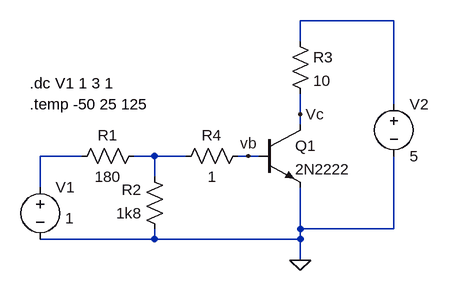
[diagram p0: schematic NPN_switch_dcSweep.asc]
NPN_switch_dcSweep.asc, the LTspice schematic file:
Version 4
SHEET 1 880 680
WIRE 544 -64 400 -64
WIRE 400 -32 400 -64
WIRE 544 64 544 -64
WIRE 400 80 400 48
WIRE 400 96 400 80
WIRE 64 144 0 144
WIRE 176 144 144 144
WIRE 224 144 176 144
WIRE 320 144 304 144
WIRE 336 144 320 144
WIRE 176 176 176 144
WIRE 0 192 0 144
WIRE 400 256 400 192
WIRE 544 256 544 144
WIRE 544 256 400 256
WIRE 176 272 176 256
WIRE 176 272 0 272
WIRE 400 272 400 256
WIRE 400 272 176 272
WIRE 400 304 400 272
FLAG 400 304 0
FLAG 400 80 Vc
FLAG 320 144 vb
SYMBOL res 160 128 R90
WINDOW 0 0 56 VBottom 2
WINDOW 3 32 56 VTop 2
SYMATTR InstName R1
SYMATTR Value 180
SYMBOL res 192 272 R180
WINDOW 0 36 76 Left 2
WINDOW 3 36 40 Left 2
SYMATTR InstName R2
SYMATTR Value 1k8
SYMBOL npn 336 96 R0
SYMATTR InstName Q1
SYMATTR Value 2N2222
SYMBOL res 384 -48 R0
SYMATTR InstName R3
SYMATTR Value 10
SYMBOL voltage 0 176 R0
WINDOW 3 38 64 Left 2
WINDOW 123 0 0 Left 0
WINDOW 39 0 0 Left 0
SYMATTR InstName V1
SYMATTR Value 1
SYMBOL voltage 544 48 R0
WINDOW 123 0 0 Left 0
WINDOW 39 0 0 Left 0
SYMATTR InstName V2
SYMATTR Value 5
SYMBOL res 320 128 R90
WINDOW 0 0 56 VBottom 2
WINDOW 3 32 56 VTop 2
SYMATTR InstName R4
SYMATTR Value 1
TEXT -16 32 Left 2 !.dc V1 1 3 1
TEXT -16 64 Left 2 !.temp -50 25 125

The netlist it stands for:
* NPN_switch_dcSweep.asc
R1 N003 N002 180
R2 0 N003 1k8
Q1 Vc vb 0 0 2N2222
R3 N001 Vc 10
V1 N002 0 1
V2 N001 0 5
R4 vb N003 1
.model NPN NPN
.model PNP PNP
.lib standard.bjt
.dc V1 1 3 1
.temp -50 25 125
.backanno
.end

* Results of the author's LTspice run, read from the files saved beside the schematic
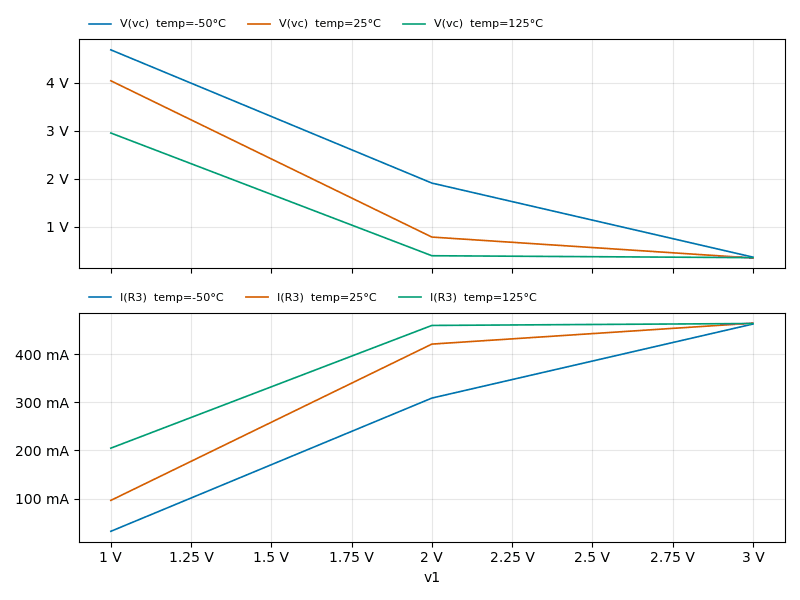
[diagram p1: DC transfer characteristic of NPN_switch_dcSweep.asc, plotted from the saved traces]
* DC transfer characteristic, 3 runs:
*   V(vc) [temp=-50°C]: 4.682 V at v1=1 V, 372 mV at v1=3 V, min 372 mV, max 4.682 V
*   V(vc) [temp=25°C]: 4.039 V at v1=1 V, 353.4 mV at v1=3 V, min 353.4 mV, max 4.039 V
*   V(vc) [temp=125°C]: 2.953 V at v1=1 V, 361.3 mV at v1=3 V, min 361.3 mV, max 2.953 V
*   I(R3) [temp=-50°C]: 31.84 mA at v1=1 V, 462.8 mA at v1=3 V, min 31.84 mA, max 462.8 mA
*   I(R3) [temp=25°C]: 96.12 mA at v1=1 V, 464.7 mA at v1=3 V, min 96.12 mA, max 464.7 mA
*   I(R3) [temp=125°C]: 204.7 mA at v1=1 V, 463.9 mA at v1=3 V, min 204.7 mA, max 463.9 mA